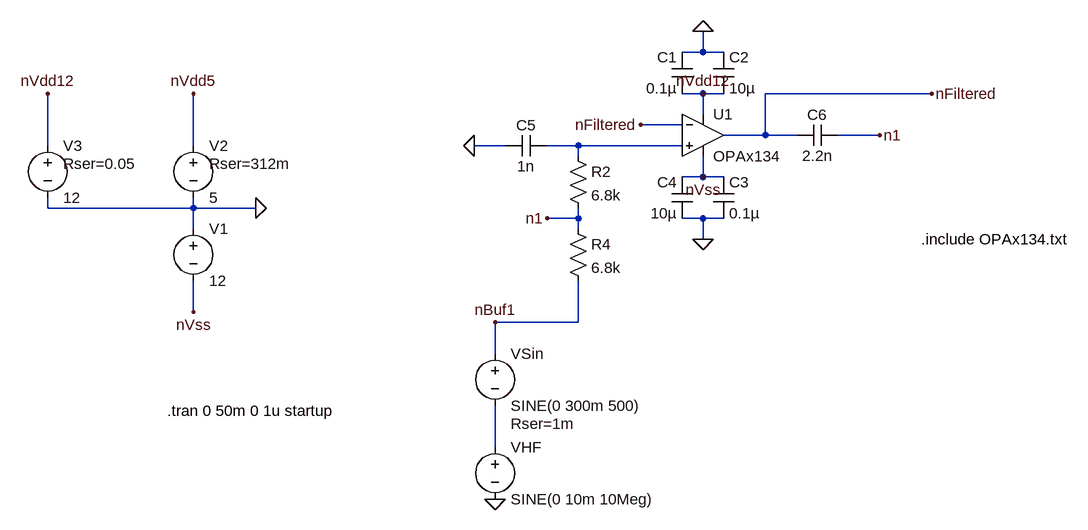
[diagram p0: schematic Stage2Filter.asc]
Stage2Filter.asc, the LTspice schematic file:
Version 4
SHEET 1 1844 708
WIRE 1056 0 1056 -32
WIRE 1056 0 1024 0
WIRE 1088 0 1056 0
WIRE 1056 64 1024 64
WIRE 1088 64 1056 64
WIRE 1408 64 1152 64
WIRE 1056 96 1056 64
WIRE 1024 112 960 112
WIRE 1152 128 1152 64
WIRE 1152 128 1088 128
WIRE 1200 128 1152 128
WIRE 1328 128 1264 128
WIRE 48 144 48 64
WIRE 272 144 272 64
WIRE 752 144 704 144
WIRE 864 144 816 144
WIRE 1024 144 864 144
WIRE 864 160 864 144
WIRE 1056 192 1056 160
WIRE 1056 192 1024 192
WIRE 1088 192 1056 192
WIRE 48 240 48 224
WIRE 272 240 272 224
WIRE 272 240 48 240
WIRE 368 240 272 240
WIRE 864 256 864 240
WIRE 864 256 816 256
WIRE 1056 256 1024 256
WIRE 1088 256 1056 256
WIRE 272 272 272 240
WIRE 864 272 864 256
WIRE 1056 288 1056 256
WIRE 272 400 272 352
WIRE 864 416 864 352
WIRE 864 416 736 416
WIRE 736 464 736 416
WIRE 736 608 736 544
FLAG 368 240 0
FLAG 272 400 nVss
FLAG 272 64 nVdd5
FLAG 48 64 nVdd12
FLAG 1056 64 nVdd12
FLAG 1056 192 nVss
FLAG 1328 128 n1
FLAG 1408 64 nFiltered
FLAG 704 144 0
FLAG 960 112 nFiltered
FLAG 816 256 n1
FLAG 1056 -32 0
FLAG 1056 288 0
FLAG 736 688 0
FLAG 736 416 nBuf1
SYMBOL voltage 272 256 R0
WINDOW 123 0 0 Left 0
WINDOW 39 0 0 Left 0
SYMATTR InstName V1
SYMATTR Value 12
SYMBOL voltage 272 128 R0
WINDOW 123 0 0 Left 0
WINDOW 39 24 44 Left 2
SYMATTR SpiceLine Rser=312m
SYMATTR InstName V2
SYMATTR Value 5
SYMBOL voltage 48 128 R0
WINDOW 123 0 0 Left 0
WINDOW 39 24 44 Left 2
SYMATTR SpiceLine Rser=0.05
SYMATTR InstName V3
SYMATTR Value 12
SYMBOL OpAmps\\opamp2 1056 64 R0
SYMATTR InstName U1
SYMATTR Value OPAx134
SYMBOL cap 1040 64 R180
WINDOW 0 24 56 Left 2
WINDOW 3 24 8 Left 2
SYMATTR InstName C1
SYMATTR Value 0.1µ
SYMATTR SpiceLine V=16 Irms=0.6 Rser=0.05
SYMBOL cap 1072 0 R0
SYMATTR InstName C2
SYMATTR Value 10µ
SYMATTR SpiceLine V=10 Irms=1.25 Rser=5m
SYMBOL cap 1072 192 R0
SYMATTR InstName C3
SYMATTR Value 0.1µ
SYMATTR SpiceLine V=16 Irms=0.6 Rser=0.05
SYMBOL cap 1040 256 R180
WINDOW 0 24 56 Left 2
WINDOW 3 24 8 Left 2
SYMATTR InstName C4
SYMATTR Value 10µ
SYMATTR SpiceLine V=10 Irms=1.25 Rser=5m
SYMBOL cap 816 128 R90
WINDOW 0 0 32 VBottom 2
WINDOW 3 32 32 VTop 2
SYMATTR InstName C5
SYMATTR Value 1n
SYMATTR SpiceLine V=50 Irms=0.2 Rser=300m
SYMBOL cap 1264 112 R90
WINDOW 0 0 32 VBottom 2
WINDOW 3 32 32 VTop 2
SYMATTR InstName C6
SYMATTR Value 2.2n
SYMATTR SpiceLine V=50 Irms=0.15 Rser=250m
SYMBOL res 848 144 R0
SYMATTR InstName R2
SYMATTR Value 6.8k
SYMATTR SpiceLine tol=1 pwr=0.25
SYMBOL res 848 256 R0
SYMATTR InstName R4
SYMATTR Value 6.8k
SYMATTR SpiceLine tol=1 pwr=0.25
SYMBOL voltage 736 448 R0
WINDOW 123 0 0 Left 0
WINDOW 39 24 124 Left 2
SYMATTR SpiceLine Rser=1m
SYMATTR InstName VSin
SYMATTR Value SINE(0 300m 500)
SYMBOL voltage 736 592 R0
WINDOW 123 0 0 Left 0
WINDOW 39 0 0 Left 0
SYMATTR InstName VHF
SYMATTR Value SINE(0 10m 10Meg)
TEXT 232 552 Left 2 !.tran 0 50m 0 1u startup
TEXT 1392 288 Left 2 !.include OPAx134.txt

The netlist it stands for:
* Stage2Filter.asc
V1 0 nVss 12
V2 nVdd5 0 5 Rser=312m
V3 nVdd12 0 12 Rser=0.05
XU1 N001 nFiltered nVdd12 nVss nFiltered OPAx134  ; pins In+ In- V+ V- OUT
C1 nVdd12 0 0.1µ V=16 Irms=0.6 Rser=0.05
C2 0 nVdd12 10µ V=10 Irms=1.25 Rser=5m
C3 nVss 0 0.1µ V=16 Irms=0.6 Rser=0.05
C4 0 nVss 10µ V=10 Irms=1.25 Rser=5m
C5 N001 0 1n V=50 Irms=0.2 Rser=300m
C6 n1 nFiltered 2.2n V=50 Irms=0.15 Rser=250m
R2 N001 n1 6.8k tol=1 pwr=0.25
R4 n1 nBuf1 6.8k tol=1 pwr=0.25
VSin nBuf1 N002 SINE(0 300m 500) Rser=1m
VHF N002 0 SINE(0 10m 10Meg)
.tran 0 50m 0 1u startup
.include OPAx134.txt
.backanno
.end